# Altium schematic sheet ultrasonic.SCHDOC
size A4
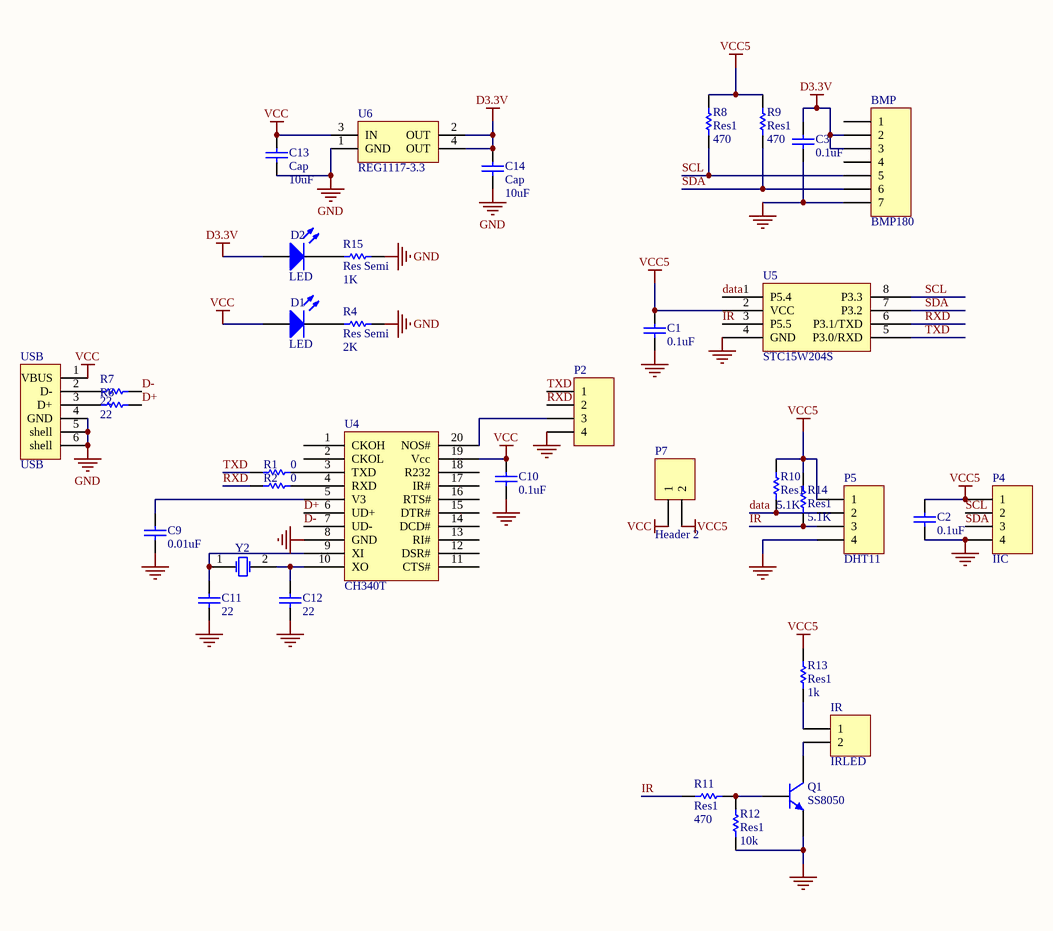
[diagram p0: ultrasonic.SCHDOC]

## Parts
BMP  BMP180  [BMP180]
C1  value 0.1uF  [C0603]  (hidden comment: Cap)
C2  value 0.1uF  [C0603]  (hidden comment: Cap)
C3  value 0.1uF  [C0603]  (hidden comment: Cap)
C9  value 0.01uF  [C0603]  (hidden comment: Cap)
C10  value 0.1uF  [C0603]  (hidden comment: Cap)
C11  value 22  [C0603]  (hidden comment: Cap)
C12  value 22  [C0603]  (hidden comment: Cap)
C13  Cap  value 10uF  [CAP0805(2512)]
C14  Cap  value 10uF  [RES0805(2012M)]
D1  LED  [LED_0805]
D2  LED  [LED_0805]
IR  IRLED  [HDR1X2]
P2  Header 4  [HDR1X4]  (value not drawn)
P4  IIC  [HDR1X4]
P5  DHT11  [HDR1X4]
P7  Header 2  [HDR1X2]
Q1  SS8050  [SOT95P240-3N]
R1  value 0  [C0603]  (hidden comment: Res Semi)
R2  value 0  [C0603]  (hidden comment: Res Semi)
R4  Res Semi  value 2K  [C0603]
R6  value 22  [C0603]  (hidden comment: Res Semi)
R7  value 22  [C0603]  (hidden comment: Res Semi)
R8  Res1  value 470  [C0603]
R9  Res1  value 470  [C0603]
R10  Res1  value 5.1K  [C0603]
R11  Res1  value 470  [C0603]
R12  Res1  value 10k  [C0603]
R13  Res1  value 1k  [RES0805(2012M)]
R14  Res1  value 5.1K  [C0603]
R15  Res Semi  value 1K  [C0603]
U4  CH340T  [SOP20]
U5  STC15W204S  [SOP8]
U6  REG1117-3.3  [ZZ311]
USB  USB  [USB-JSZ]
Y2  XTAL  [XTAL-5032]  (value not drawn)

## Nets
D3.3V: BMP.2 BMP.3 C3.2 C14.1 D2.1(A) U6.2(OUT) U6.4(OUT)
GND: BMP.7 C1.1 C2.1 C3.1 C9.1 C10.1 C11.1 C12.1 C13.2 C14.2 P2.4 P4.4 P5.4 Q1.3(E) R4.1 R12.2 R15.1 U4.8(GND) U5.4(GND) U6.1(GND) USB.4(GND) USB.5(shell) USB.6(shell)
VCC: C10.2 C13.1 D1.1(A) P7.1 U4.19(Vcc) U6.3(IN) USB.1(VBUS)
VCC5: C1.2 C2.2 P4.1 P5.1 P7.2 R8.2 R9.2 R10.2 R13.1 R14.2 U5.2(VCC)
D+: R6.2 U4.6(UD+)
D-: R7.2 U4.7(UD-)
data: P5.2 R10.1 U5.1(P5.4)
IR: P5.3 R11.2 R14.1 U5.3(P5.5)
RXD: P2.2 R2.1 U5.6(P3.1/TXD)
SCL: BMP.5 P4.2 R8.1 U5.8(P3.3)
SDA: BMP.6 P4.3 R9.1 U5.7(P3.2)
TXD: P2.1 R1.1 U5.5(P3.0/RXD)
NetC9_2: C9.2 U4.5(V3)
NetC11_2: C11.2 U4.9(XI) Y2.1(OSC1)
NetC12_2: C12.2 U4.10(XO) Y2.2(OSC2)
NetD1_2: D1.2(K) R4.2
NetD2_2: D2.2(K) R15.2
NetIR_1: IR.1 R13.2
NetIR_2: IR.2 Q1.1(C)
NetP2_3: P2.3 U4.20(NOS#)
NetQ1_2: Q1.2(B) R11.1 R12.1
NetR1_2: R1.2 U4.3(TXD)
NetR2_2: R2.2 U4.4(RXD)
NetR6_1: R6.1 USB.3(D+)
NetR7_1: R7.1 USB.2(D-)

Not connected (* = marked no-connect by the designer): BMP 1 4; U4 1(CKOH) 2(CKOL) 11(CTS#) 12(DSR#) 13(RI#) 14(DCD#) 15(DTR#) 16(RTS#) 17(IR#) 18(R232)

## Library data of the parts
BMP = Header 7: Header, 7-Pin; LatestRevisionDate: 17-Jul-2002; LatestRevisionNote: Re-released for DXP Platform.; Publisher: Altium Limited
C1-C3 C9-C14 = Cap: Capacitor; Published: 8-Jun-2000; LatestRevisionDate: 17-Jul-2002; LatestRevisionNote: Re-released for DXP Platform.; Publisher: Altium Limited
  C13 C14: PackageReference: RAD-0.3
D1 D2 = LED3: Typical BLUE SiC LED; Published: 8-Jun-2000; LatestRevisionDate: 17-Dec-2003; LatestRevisionNote: PCB Footprint replaced.; DatasheetVersion: 16-Apr-2002; PackageVersion: 16-Apr-2002; PackageReference: 3.5X2.8X1.9; Publisher: Altium Limited
IR P7 = Header 2: Header, 2-Pin; LatestRevisionDate: 17-Jul-2002; LatestRevisionNote: Re-released for DXP Platform.; Publisher: Altium Limited
P2 P4 P5 = Header 4: Header, 4-Pin; LatestRevisionDate: 17-Jul-2002; LatestRevisionNote: Re-released for DXP Platform.; Publisher: Altium Limited
Q1 = NPN: NPN Bipolar Transistor; pin to pad: 1>3 2>1 3>2; Published: 8-Jun-2000; LatestRevisionDate: 17-Jul-2002; LatestRevisionNote: Re-released for DXP Platform.; PackageReference: TO-226; Publisher: Altium Limited; Code_JEDEC: TO-226-AA
R1 R2 R4 R6 R7 R15 = Res Semi: Semiconductor Resistor; Published: 8-Jun-2000; LatestRevisionDate: 17-Jul-2002; LatestRevisionNote: Re-released for DXP Platform.; PackageReference: RES0805(2012M); Publisher: Altium Limited
R8-R14 = Res1: Resistor; Published: 8-Jun-2000; LatestRevisionDate: 17-Jul-2002; LatestRevisionNote: Re-released for DXP Platform.; PackageReference: AXIAL-0.3; Publisher: Altium Limited; PackageDescription: Axial Device, Thru-Hole; 2 Leads; 0.3 in Pin Spacing
U4 = CH340
U5 = stc15f204s_sop8
U6 = REG1117-3.3: 800mA and 1A Low Dropout Positive Regulator 2.85V, 3.3V, 5V, and Adjustable; Published: 8-Jun-2000; LatestRevisionDate: 17-Jul-2002; LatestRevisionNote: Re-released for DXP Platform.; DatasheetVersion: Sep-1997; PackageVersion: revC; PackageReference: ZZ311; Publisher: Altium Limited; PackageDescription: SOT-223/SC-73; 4 Leads; Body 6.7 x 7.3 mm, inc. leads (LxW max); ComponentLink1Description: Manufacturer Link; ComponentLink1URL: http://www.ti.com/; ComponentLink2Description: Datasheet; ComponentLink2URL: http://www-s.ti.com/sc/ds/REG1117.pdf
Y2 = XTAL: Crystal Oscillator; Published: 8-Jun-2000; LatestRevisionDate: 17-Jul-2002; LatestRevisionNote: Re-released for DXP Platform.; Publisher: Altium Limited